# EAGLE design ranback_top (EAGLE 9.6.2)
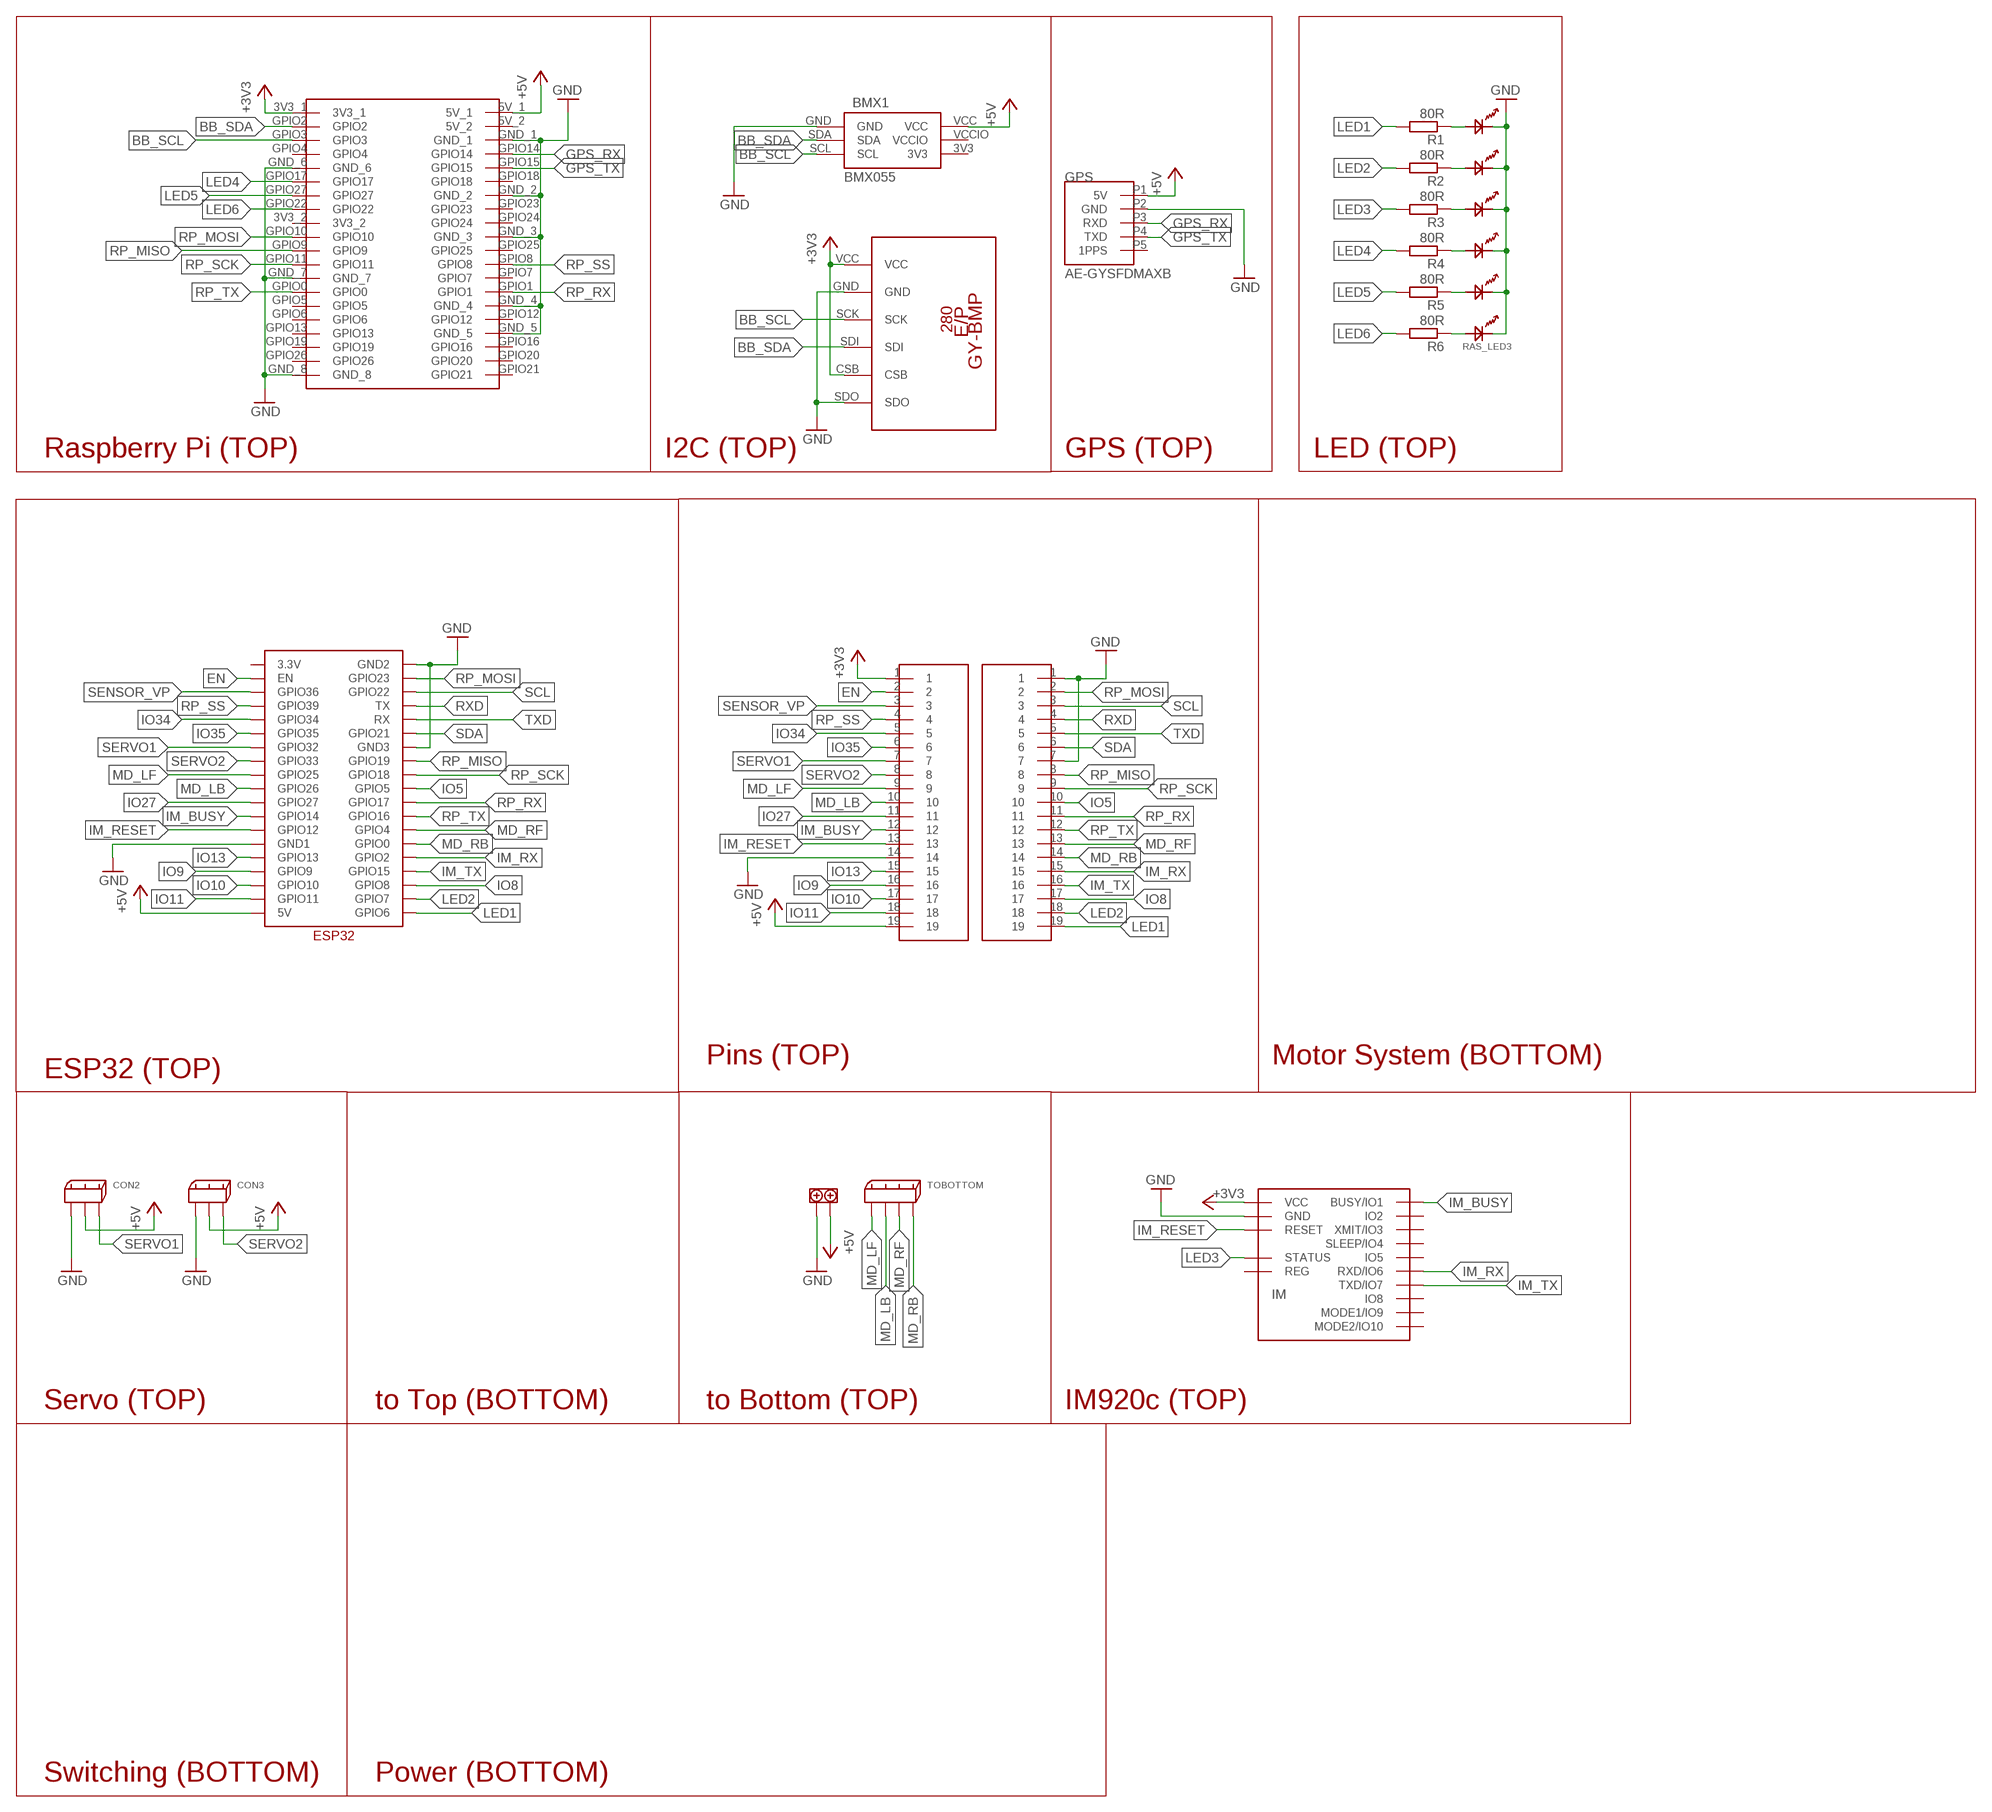
[diagram p0: schematic, sheet 1]

## Parts
BMX1  BMX055  [BMX055]
CON2  2.5_MINI-SPOX_3PIN  [2.5_MINI-SPOX_3PIN]
CON3  2.5_MINI-SPOX_3PIN  [2.5_MINI-SPOX_3PIN]
ESP_LED1  OSXX1608C1A  [OSXX1608C1A]
ESP_LED2  OSXX1608C1A  [OSXX1608C1A]
GPS  AE-GYSFDMAXB  [AE-GYSFDMAXB]
IM  IM920C  [IM920C]
IMCHECK  OSXX1608C1A  [OSXX1608C1A]
PIN_L  19_2.54  [19_2.54]
PIN_R  19_2.54  [19_2.54]
R1  80R  R-EU_0207/10  [0207/10]
R2  80R  R-EU_0207/10  [0207/10]
R3  80R  R-EU_0207/10  [0207/10]
R4  80R  R-EU_0207/10  [0207/10]
R5  80R  R-EU_0207/10  [0207/10]
R6  80R  R-EU_0207/10  [0207/10]
RAS_LED1  OSXX1608C1A  [OSXX1608C1A]
RAS_LED2  OSXX1608C1A  [OSXX1608C1A]
RAS_LED3  OSXX1608C1A  [OSXX1608C1A]
RASPBERRYPI_4B  RASPBERRYPI4B  [RASPBERRYPI4B]
TM5  TERMINAL_SLOPED_2PIN  [TERMINAL_SLOPED_2PIN]
TOBOTTOM  2.5_MINI-SPOX_4PIN  [2.5_MINI-SPOX_4PIN]
U$2  ESP32  [ESP32]
U$9  GY-BPM280  [GY-BMP280-FOOTPRINT]

## Nets
+3V3: IM.$P17(VCC) PIN_L.1 RASPBERRYPI_4B.3V3_1 U$9.CSB U$9.VCC
+5V: BMX1.VCC CON2.2 CON3.2 GPS.P1(5V) PIN_L.19 RASPBERRYPI_4B.5V_1 TM5.1 U$2.5V
BB_SCL: BMX1.SCL RASPBERRYPI_4B.GPIO3 U$9.SCK
BB_SDA: BMX1.SDA RASPBERRYPI_4B.GPIO2 U$9.SDI
EN: PIN_L.2 U$2.EN
GND [GND_+12V]: BMX1.GND CON2.1 CON3.1 ESP_LED1.CT ESP_LED2.CT GPS.P2(GND) IM.$P18(GND) IMCHECK.CT PIN_L.14 PIN_R.1 PIN_R.7 RAS_LED1.CT RAS_LED2.CT RAS_LED3.CT RASPBERRYPI_4B.GND_1 RASPBERRYPI_4B.GND_2 RASPBERRYPI_4B.GND_3 RASPBERRYPI_4B.GND_4 RASPBERRYPI_4B.GND_5 RASPBERRYPI_4B.GND_6 RASPBERRYPI_4B.GND_7 RASPBERRYPI_4B.GND_8 TM5.2 U$2.GND1 U$2.GND2 U$2.GND3 U$9.GND U$9.SDO
GPS_RX: GPS.P3(RXD) RASPBERRYPI_4B.GPIO14
GPS_TX: GPS.P4(TXD) RASPBERRYPI_4B.GPIO15
IM_BUSY: IM.$P1(BUSY/IO1) PIN_L.12 U$2.GPIO14
IM_RESET: IM.$P19(RESET) PIN_L.13 U$2.GPIO12
IM_RX: IM.$P6(RXD/IO6) PIN_R.15 U$2.GPIO2
IM_TX: IM.$P7(TXD/IO7) PIN_R.16 U$2.GPIO15
IO5: PIN_R.10 U$2.GPIO5
IO8: PIN_R.17 U$2.GPIO8
IO9: PIN_L.16 U$2.GPIO9
IO10: PIN_L.17 U$2.GPIO10
IO11: PIN_L.18 U$2.GPIO11
IO13: PIN_L.15 U$2.GPIO13
IO27: PIN_L.11 U$2.GPIO27
IO34: PIN_L.5 U$2.GPIO34
IO35: PIN_L.6 U$2.GPIO35
LED1: PIN_R.19 R1.2 U$2.GPIO6
LED2: PIN_R.18 R2.2 U$2.GPIO7
LED3: IM.$P15(STATUS) R3.2
LED4: R4.2 RASPBERRYPI_4B.GPIO17
LED5: R5.2 RASPBERRYPI_4B.GPIO27
LED6: R6.2 RASPBERRYPI_4B.GPIO22
MD_LB: PIN_L.10 TOBOTTOM.P$2 U$2.GPIO26
MD_LF: PIN_L.9 TOBOTTOM.P$1 U$2.GPIO25
MD_RB: PIN_R.14 TOBOTTOM.P$4 U$2.GPIO0
MD_RF: PIN_R.13 TOBOTTOM.P$3 U$2.GPIO4
N$1: ESP_LED1.AN R1.1
N$2: ESP_LED2.AN R2.1
N$3: IMCHECK.AN R3.1
N$4: R4.1 RAS_LED1.AN
N$5: R5.1 RAS_LED2.AN
N$6: R6.1 RAS_LED3.AN
RP_MISO: PIN_R.8 RASPBERRYPI_4B.GPIO9 U$2.GPIO19
RP_MOSI: PIN_R.2 RASPBERRYPI_4B.GPIO10 U$2.GPIO23
RP_RX: PIN_R.11 RASPBERRYPI_4B.GPIO1 U$2.GPIO17
RP_SCK: PIN_R.9 RASPBERRYPI_4B.GPIO11 U$2.GPIO18
RP_SS: PIN_L.4 RASPBERRYPI_4B.GPIO8 U$2.GPIO39
RP_TX: PIN_R.12 RASPBERRYPI_4B.GPIO0 U$2.GPIO16
RXD [esp]: PIN_R.4 U$2.TX
SCL: PIN_R.3 U$2.GPIO22
SDA: PIN_R.6 U$2.GPIO21
SENSOR_VP: PIN_L.3 U$2.GPIO36
SERVO1: CON2.3 PIN_L.7 U$2.GPIO32
SERVO2: CON3.3 PIN_L.8 U$2.GPIO33
TXD [esp]: PIN_R.5 U$2.RX
Unconnected: GPS.P5(1PPS) IM.$P2(IO2) IM.$P3(XMIT/IO3) IM.$P4(SLEEP/IO4) IM.$P5(IO5) IM.$P8(IO8) IM.$P9(MODE1/IO9) IM.$P10(MODE2/IO10) IM.$P16(REG) RASPBERRYPI_4B.3V3_2 RASPBERRYPI_4B.5V_2 RASPBERRYPI_4B.GPIO4 RASPBERRYPI_4B.GPIO5 RASPBERRYPI_4B.GPIO6 RASPBERRYPI_4B.GPIO7 RASPBERRYPI_4B.GPIO12 RASPBERRYPI_4B.GPIO13 RASPBERRYPI_4B.GPIO16 RASPBERRYPI_4B.GPIO18 RASPBERRYPI_4B.GPIO19 RASPBERRYPI_4B.GPIO20 RASPBERRYPI_4B.GPIO21 RASPBERRYPI_4B.GPIO23 RASPBERRYPI_4B.GPIO24 RASPBERRYPI_4B.GPIO25 RASPBERRYPI_4B.GPIO26 U$2.3.3V

## Notes on the sheet
- Raspberry Pi (TOP) | I2C (TOP) | GPS (TOP) | LED (TOP)
- Pins (TOP) | Motor System (BOTTOM)
- ESP32 (TOP)
- Servo (TOP) | to Top (BOTTOM) | to Bottom (TOP) | IM920c (TOP)
- Switching (BOTTOM) | Power (BOTTOM)

## Power pins joined to a net without a drawn wire
3V3: BMX1.3V3
VCCIO: BMX1.VCCIO

## Library data of the parts
BMX1 = BMX055:BMX055
CON2 CON3 = Connector:2.5_MINI-SPOX_3PIN
ESP_LED1 ESP_LED2 IMCHECK RAS_LED1-RAS_LED3 = ChipLED:OSXX1608C1A
GPS = AE-GYSFDMAXB:AE-GYSFDMAXB
IM = IM920:IM920C
PIN_L PIN_R = JumperPins:19_2.54
R1-R6 = rcl:R-EU_: RESISTOR, European symbol; SPICEPREFIX: R
RASPBERRYPI_4B = RASPBERRYPI4B:RASPBERRYPI4B
TM5 = TerminalBrock:TERMINAL_SLOPED_2PIN
TOBOTTOM = Connector:2.5_MINI-SPOX_4PIN
U$2 = ESP32_dev:ESP32
U$9 = BMP280:GY-BPM280

## Net classes
1 esp: width 0.254 mm, drill 0.127 mm, clearance 0.025 mm
2 GND_+12V: width 0.305 mm

## Board
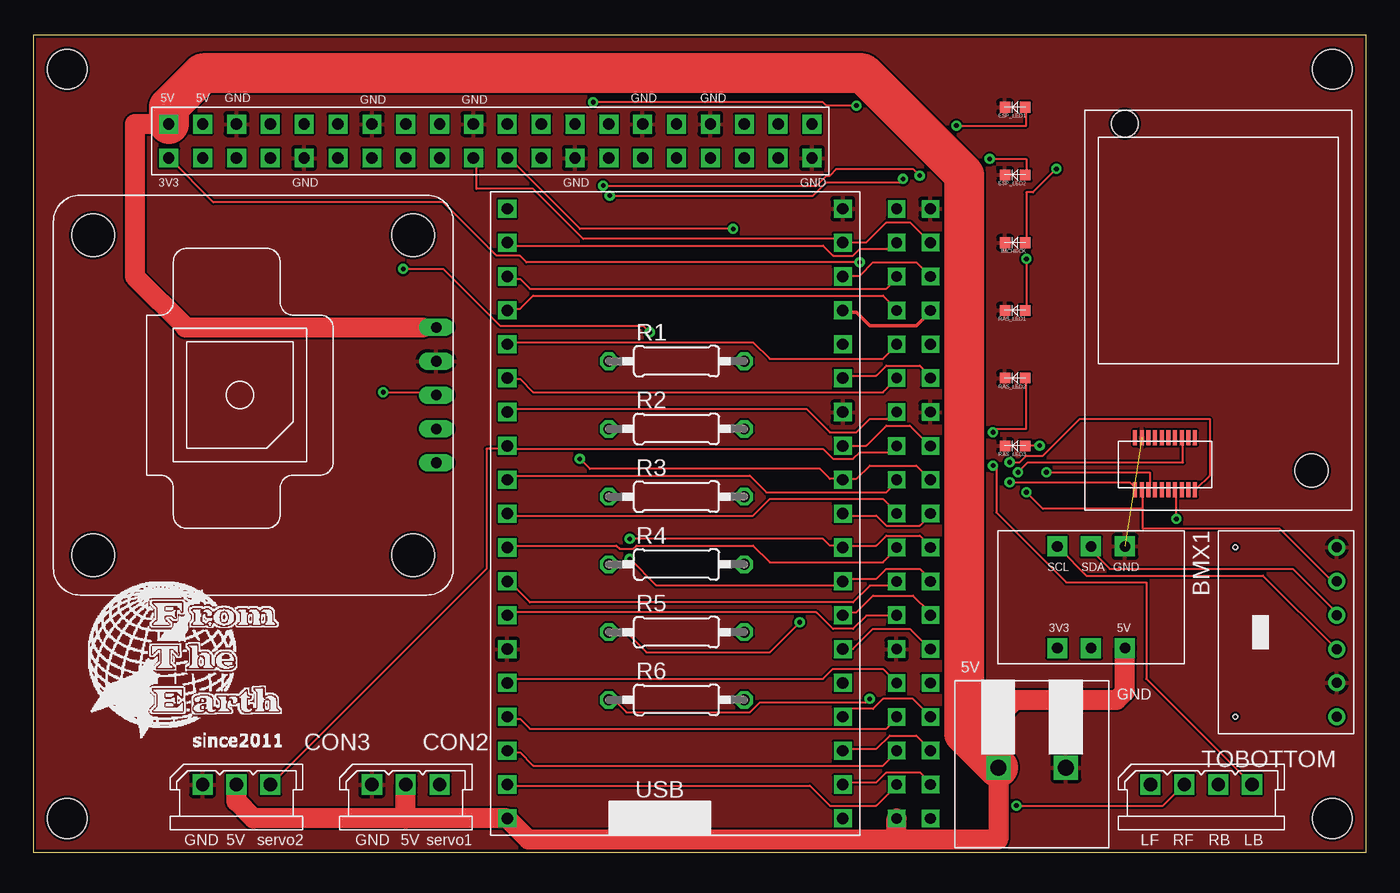
[diagram p1: board, top side]
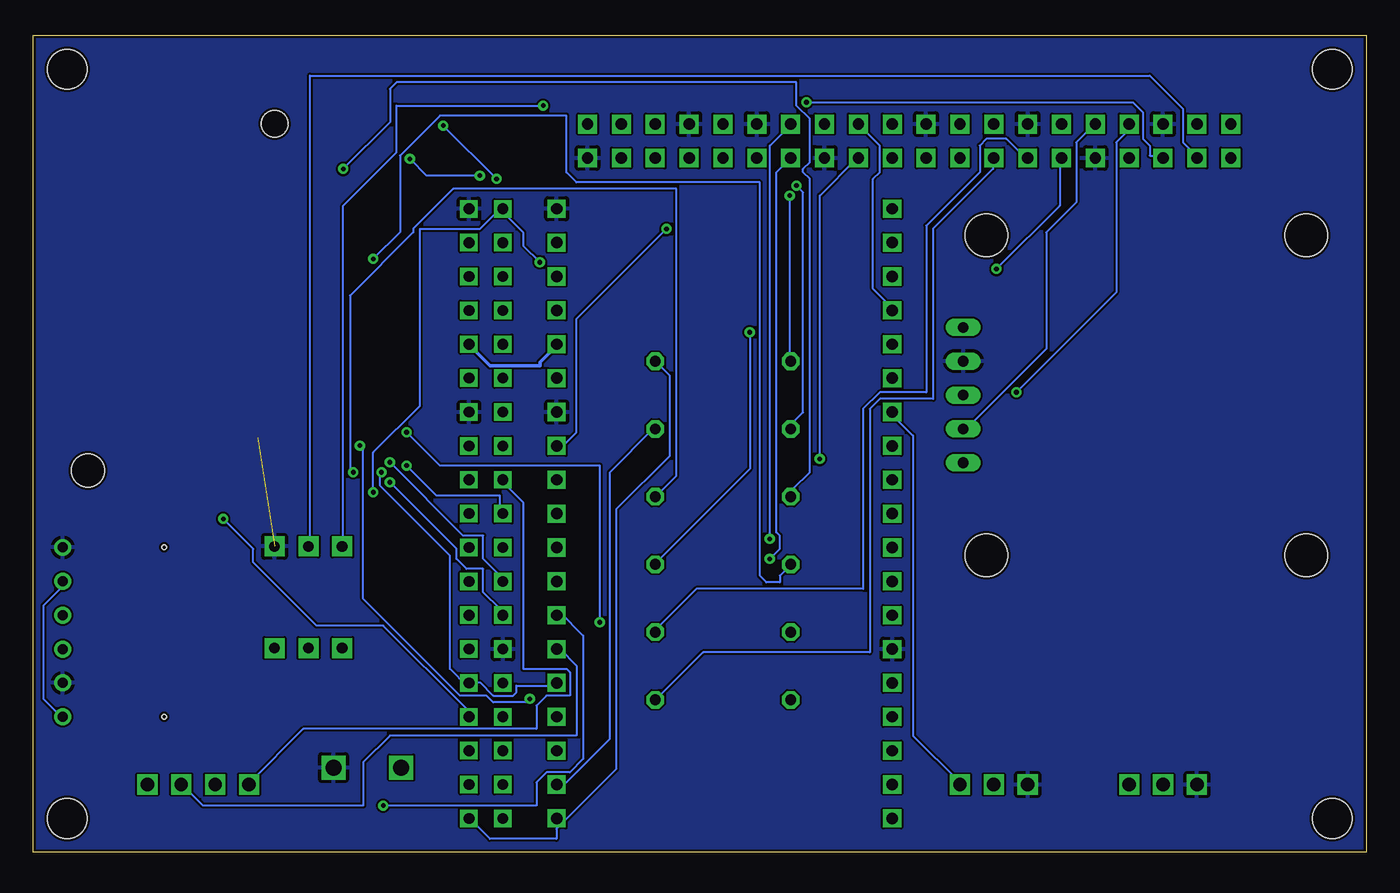
[diagram p2: board, bottom side, seen from below]

Size 100 x 61.27 mm. Coordinates in mm from the lower left corner, seen from the top.
Outline: 0,0 100,0 100,61.27 0,61.27 0,0
Copper layers (1*16): Top 0.035mm / dielectric 1.5mm / Bottom 0.035mm
Design rules "PCBGoGo": minimum track width 6mil, minimum drill 0.2mm, track to track 6mil, track to pad 6mil, pad to pad 6mil, via to via 6mil, smd to smd 6mil, copper to edge 0.2mm, drill to drill 6mil, minimum pad ring 10mil, minimum via ring 8mil, stop-mask expansion 4mil, vias tented up to drill 0mil, thermal gap 10mil
Holes 3 mm at 2.54,2.54 2.54,58.73 97.46,58.73 97.46,2.54

### Footprints (pad centres in the part's own frame; a part is rotated, then mirrored left to right if it is on the bottom)
BMX055 = drill 0.8 pad 1.5 square: 3V3 8.81,-9.53; GND 1.19,-4.46; SCL 1.19,-9.53; SDA 1.19,-7; VCC 8.81,-4.46; VCCIO 8.81,-7
2.5_MINI-SPOX_3PIN = drill 1 square: 1 -1.27,0; 2 1.27,0; 3 3.81,0
OSXX1608C1A = smd 0.8 x 0.8: AN -0.75,0; CT 0.75,0
AE-GYSFDMAXB = drill 0.8 long: P1 13.716,5.08; P2 13.716,2.54; P3 13.716,0; P4 13.716,-2.54; P5 13.716,-5.08 | hole 3.2: -12,12; 12,12; 12,-12; -12,-12
IM920C = smd 0.3 x 1.1: $P1 -1.75,-13.45; $P2 -1.75,-9.55; $P3 -2.25,-13.45; $P4 -2.25,-9.55; $P5 -2.75,-13.45; $P6 -2.75,-9.55; $P7 -3.25,-13.45; $P8 -3.25,-9.55; $P9 -3.75,-13.45; $P10 -3.75,-9.55; $P11 -4.25,-13.45; $P12 -4.25,-9.55; $P13 -4.75,-13.45; $P14 -4.75,-9.55; $P15 -5.25,-13.45; $P16 -5.25,-9.55; $P17 -5.75,-13.45; $P18 -5.75,-9.55; $P19 -6.25,-13.45; $P20 -6.25,-9.55 | hole 2.5: 7,-12 | hole 2: -7,14
19_2.54 = drill 0.8 pad 1.27 square: 1 0,12.7; 2 0,10.16; 3 0,7.62; 4 0,5.08; 5 0,2.54; 6 0,0; 7 0,-2.54; 8 0,-5.08; 9 0,-7.62; 10 0,-10.16; 11 0,-12.7; 12 0,-15.24; 13 0,-17.78; 14 0,-20.32; 15 0,-22.86; 16 0,-25.4; 17 0,-27.94; 18 0,-30.48; 19 0,-33.02
0207/10 = drill 0.813 octagon: 1 -5.08,0; 2 5.08,0
RASPBERRYPI4B = drill 0.85 pad 1.422 square: 3V3_1 -2.54,-2.54; 3V3_2 -2.54,-22.86; 5V_1 0,-2.54; 5V_2 0,-5.08; GND_1 0,-7.62; GND_2 0,-17.78; GND_3 0,-25.4; GND_4 0,-38.1; GND_5 0,-43.18; GND_6 -2.54,-12.7; GND_7 -2.54,-33.02; GND_8 -2.54,-50.8; GPIO0 -2.54,-35.56; GPIO1 0,-35.56; GPIO2 -2.54,-5.08; GPIO3 -2.54,-7.62; GPIO4 -2.54,-10.16; GPIO5 -2.54,-38.1; GPIO6 -2.54,-40.64; GPIO7 0,-33.02; GPIO8 0,-30.48; GPIO9 -2.54,-27.94; GPIO10 -2.54,-25.4; GPIO11 -2.54,-30.48; GPIO12 0,-40.64; GPIO13 -2.54,-43.18; GPIO14 0,-10.16; GPIO15 0,-12.7; GPIO16 0,-45.72; GPIO17 -2.54,-15.24; GPIO18 0,-15.24; GPIO19 -2.54,-45.72; GPIO20 0,-48.26; GPIO21 0,-50.8; GPIO22 -2.54,-20.32; GPIO23 0,-20.32; GPIO24 0,-22.86; GPIO25 0,-27.94; GPIO26 -2.54,-48.26; GPIO27 -2.54,-17.78
TERMINAL_SLOPED_2PIN = drill 1.2 square: 1 -2.54,0; 2 2.54,0
2.5_MINI-SPOX_4PIN = drill 1 square: P$1 -1.27,0; P$2 6.35,0; P$3 1.27,0; P$4 3.81,0
ESP32 = drill 0.85 square: 3.3V 1.27,46.99; 5V 1.27,1.27; EN 1.27,44.45; GND1 1.27,13.97; GND2 26.44,46.99; GND3 26.44,31.75; GPIO0 26.44,13.97; GPIO2 26.44,11.43; GPIO4 26.44,16.51; GPIO5 26.44,24.13; GPIO6 26.44,1.27; GPIO7 26.44,3.81; GPIO8 26.44,6.35; GPIO9 1.27,8.89; GPIO10 1.27,6.35; GPIO11 1.27,3.81; GPIO12 1.27,16.51; GPIO13 1.27,11.43; GPIO14 1.27,19.05; GPIO15 26.44,8.89; GPIO16 26.44,19.05; GPIO17 26.44,21.59; GPIO18 26.44,26.67; GPIO19 26.44,29.21; GPIO21 26.44,34.29; GPIO22 26.44,41.91; GPIO23 26.44,44.45; GPIO25 1.27,26.67; GPIO26 1.27,24.13; GPIO27 1.27,21.59; GPIO32 1.27,31.75; GPIO33 1.27,29.21; GPIO34 1.27,36.83; GPIO35 1.27,34.29; GPIO36 1.27,41.91; GPIO39 1.27,39.37; RX 26.44,36.83; TX 26.44,39.37
GY-BMP280-FOOTPRINT = drill 0.75 pad 1.27: CSB 11.43,0; GND 3.81,0; SCK 6.35,0; SDI 8.89,0; SDO 13.97,0; VCC 1.27,0 | hole 0.35: 1.27,7.62; 13.97,7.62

### Placement (x,y rotation side)
BMX1  86.36,24.13 270 top
CON2  26.67,5.08 0 top
CON3  13.97,5.08 0 top
ESP_LED1  73.66,55.88 180 top
ESP_LED2  73.66,50.8 180 top
GPS  16.51,34.29 0 top
IM  88.9,40.64 0 top
IMCHECK  73.66,45.72 180 top
PIN_L  64.77,35.56 0 top
PIN_R  67.31,35.56 0 top
R1  48.26,36.83 0 top
R2  48.26,31.75 0 top
R3  48.26,26.67 0 top
R4  48.26,21.59 0 top
R5  48.26,16.51 0 top
R6  48.26,11.43 0 top
RAS_LED1  73.66,40.64 180 top
RAS_LED2  73.66,35.56 180 top
RAS_LED3  73.66,30.48 180 top
RASPBERRYPI_4B  7.62,54.61 90 top
TM5  74.93,6.35 0 top
TOBOTTOM  85.09,5.08 0 top
U$1  [LOGO]  3.56,6.48 0 top
U$2  34.29,1.27 0 top
U$9  97.79,8.89 90 top

### Tracks (layer width: path | path; a pad name or v marks a point on that pad's centre or on a via)
+3V3  (via drill 0.35)
  Top 0.152: 83.25,25.75 83.25,24.25 93.5,24.25 97.25,20.5 97.75,20.5 U$9.CSB | 83.25,25.75 83.25,27 IM.$P17 | v74.5,27 75.75,25.75 83.25,25.75 | v62,44.25 37,44.25 36.5,44.75 34.75,44.75 30.75,48.75 13.5,48.75 10.25,52 RASPBERRYPI_4B.3V3_1
  Bottom 0.152: U$9.VCC 98,10.25 99.25,11.5 99.25,18.5 98,19.75 98,20.25 U$9.CSB | v74.5,27 74.5,30 71,33.5 71,46.75 66.5,46.75 65,48.25 PIN_L.1 64.75,48.25 64.75,48 63.25,46.5 63.25,45.5 v62,44.25
+5V
  Top 0.152: GPS.P1 30,39.5 29.75,39.5 29.21,39.37
  Top 1.5: RASPBERRYPI_4B.5V_1 7.62,54.61 7.62,43.18 11.43,39.37 29.21,39.37 | BMX1.VCC 81.9,12.05 81.28,11.43 73.66,11.43 72.39,10.16 TM5.1 72.39,0.95 64.77,0.95 | 64.77,0.95 37.15,0.95 U$2.5V 27.94,2.54 | CON3.2 15.24,3.81 16.51,2.54 27.94,2.54 | 27.94,2.54 CON2.2 | 64.77,0.95 PIN_L.19
  Top 3: TM5.1 69.85,8.89 69.85,50.8 62.23,58.42 12.7,58.42 10.16,55.88 RASPBERRYPI_4B.5V_1
BB_SCL  (via drill 0.35)
  Top 0.152: U$9.SCK 97.75,15.25 92.25,20.75 79,20.75 77,22.75 BMX1.SCL | v42,56.25 59.25,56.25 59.5,56 v61.75,56
  Bottom 0.152: v42,56.25 17.5,56.25 16.75,55.5 16.75,53.5 16.25,53 16.25,52.25 15.25,52.25 RASPBERRYPI_4B.GPIO3 | v61.75,56 72.75,56 72.75,52.5 76.75,48.5 76.75,23 BMX1.SCL
BB_SDA
  Top 0.152: U$9.SDI 97.75,18 94.5,21.25 80.75,21.25 79.25,22.75 BMX1.SDA
  Bottom 0.152: RASPBERRYPI_4B.GPIO2 12.75,52.25 13.75,53.25 13.75,55.75 16.25,58.25 79.25,58.25 79.25,23 BMX1.SDA
EN
  Top 0.152: PIN_L.2 64.75,45.5 64.5,45.25 62,45.25 61.5,44.75 60,44.75 59.25,45.5 35.75,45.5 U$2.EN
GND  (1 unrouted)
  pour Top: -1.27,62.23 101.6,62.23 101.6,-2.54 -1.27,-2.54
  pour Bottom: -1.27,62.23 101.6,62.23 101.6,-1.27 -1.27,-1.27
GPS_RX  (via drill 0.35)
  Top 0.152: v26.25,34.5 30,34.5 GPS.P3
  Bottom 0.152: v26.25,34.5 18.75,42 18.75,53.25 18,54 18,54.5 RASPBERRYPI_4B.GPIO14
GPS_TX
  Bottom 0.152: GPS.P4 30,31.75 24,37.75 24,46.5 21.75,48.75 21.75,53.25 20.5,54.5 RASPBERRYPI_4B.GPIO15
IM_BUSY  (via drill 0.35)
  Top 0.152: v73.25,29.25 74,29.25 74.5,29.75 75.75,29.75 78.5,32.5 88.25,32.5 88.25,28.25 87.25,27.25 IM.$P1 | U$2.GPIO14 35.75,20.25 37.25,18.75 61.5,18.75 62.75,20 64.5,20 64.75,20.25 PIN_L.12
  Bottom 0.152: v73.25,29.25 67.75,23.75 66.25,23.75 66.25,22 65,20.75 65,20.5 PIN_L.12
IM_RESET  (via drill 0.35)
  Top 0.152: v73.25,27.75 82.25,27.75 82.75,27.25 IM.$P19 | U$2.GPIO12 35.75,18 58.75,18 60,16.75 61.5,16.75 62.5,17.75 64.75,17.75 PIN_L.13
  Bottom 0.152: v73.25,27.75 68.25,22.75 68.25,22 67.5,21.25 66.25,21.25 66.25,19.5 65,18.25 65,18 PIN_L.13
IM_RX  (via drill 0.35)
  Top 0.152: v73.88,28.5 74.63,29.25 86.25,29.25 86.25,31 IM.$P6
  Bottom 0.152: v73.88,28.5 74,28.38 74,27.5 68.75,22.25 68.75,13.75 67.5,12.5 PIN_R.15 67.25,12.75 66.5,12.75 65.5,11.75 64,11.75 63.75,12 63.75,12.5 60.75,12.5 U$2.GPIO2
IM_TX  (via drill 0.35)
  Top 0.152: v85.75,25 85.75,27 IM.$P7 | U$2.GPIO15 60.75,10.25 61.25,10.75 63,10.75 63.75,11.5 66,11.5 67.25,10.25 PIN_R.16
  Bottom 0.152: v85.75,25 83.5,22.75 83.5,21.75 78.75,17 73.75,17 67.5,10.75 67.5,10.25 PIN_R.16
IO5
  Top 0.152: PIN_R.10 67.25,25.25 66.5,24.5 64,24.5 63.25,25.25 60.75,25.25 U$2.GPIO5
IO8
  Top 0.152: PIN_R.17 67.25,7.75 66.25,8.75 64.25,8.75 63.25,7.75 60.75,7.75 U$2.GPIO8
IO9
  Top 0.152: PIN_L.16 64.75,10 64,9.25 37.25,9.25 36.5,10 35.75,10 U$2.GPIO9
IO10
  Top 0.152: PIN_L.17 64.75,7.5 63.75,6.5 37.5,6.5 36.5,7.5 35.75,7.5 U$2.GPIO10
IO11
  Top 0.152: PIN_L.18 64.75,5 63.25,3.5 59.75,3.5 58.25,5 35.75,5 U$2.GPIO11
IO13
  Top 0.152: PIN_L.15 64.75,12.75 63.75,13.75 60,13.75 59.25,13 36,13 35.75,12.75 U$2.GPIO13
IO27
  Top 0.152: PIN_L.11 64.75,22.75 63.75,21.75 55.25,21.75 54,23 45.25,23 45,22.75 44,22.75 43.75,23 35.75,23 U$2.GPIO27
IO34
  Top 0.152: PIN_L.5 64.75,38 63.75,37 55.25,37 54,38.25 35.75,38.25 U$2.GPIO34
IO35
  Top 0.152: PIN_L.6 64.75,35.5 63.75,34.5 37.5,34.5 36.5,35.5 35.75,35.5 U$2.GPIO35
LED1
  Bottom 0.152: 60.75,1.75 60.75,2.5 U$2.GPIO6 | 60.75,1.75 60.75,1 65.75,1 67.25,2.5 PIN_R.19 | 60.75,1.75 56.25,6.25 56.25,25.75 52.25,29.75 52.25,35.75 53.25,36.75 R1.2
LED2
  Top 0.152: PIN_R.18 67.25,5.25 66.5,6 64,6 63.25,5.25 60.75,5.25 U$2.GPIO7
  Bottom 0.152: R2.2 53.5,31.75 56.75,28.5 56.75,8.5 60,5.25 60.5,5.25 U$2.GPIO7
LED3  (via drill 0.35)
  Top 0.152: v76,28.5 83.75,28.5 83.75,27.25 IM.$P15
  Bottom 0.152: v76,28.5 76.25,28.75 76.25,41.75 71.5,46.5 71.5,46.75 68.5,49.75 51.75,49.75 51.75,28.25 53.25,26.75 R3.2
LED4  (via drill 0.35)
  Top 0.152: v46.25,39 45.75,39.5 35,39.5 30.75,43.75 v27.75,43.75
  Bottom 0.152: v46.25,39 46.25,28.75 53.25,21.75 R4.2 | v27.75,43.75 23,48.5 23,52 RASPBERRYPI_4B.GPIO17
LED5
  Bottom 0.152: R5.2 53.25,16.75 50.25,19.75 37.75,19.75 37.75,33.25 36.5,34.5 33,34.5 33,47 29,51 29,53 28.5,53.5 27,53.5 25.5,52 RASPBERRYPI_4B.GPIO27
LED6
  Bottom 0.152: R6.2 53.25,11.5 49.75,15 37.25,15 37.25,33.25 36.5,34 32.5,34 32.5,46.75 28,51.25 28,52 RASPBERRYPI_4B.GPIO22
MD_LB  (via drill 0.35)
  Top 0.152: PIN_L.10 64.75,25.5 63.75,26.5 55.25,26.5 54,25.25 35.75,25.25 U$2.GPIO26 | v72,29 72.25,29 72.25,25.5 77.5,20.25 83.5,20.25 83.5,13 91.25,5.25 TOBOTTOM.P$2
  Bottom 0.152: v72,29 69.75,26.75 65,26.75 65,25.5 PIN_L.10
MD_LF
  Top 0.152: PIN_L.9 64.75,27.75 64,27 55,27 53.75,28.25 36,28.25 35.75,28 U$2.GPIO25
  Bottom 0.152: TOBOTTOM.P$1 83.75,5.25 79.75,9.25 62.25,9.25 62.25,11 61.5,11.75 59.75,11.75 59.75,13.5 60,13.75 63.25,13.75 63.25,26.25 64.75,27.75 PIN_L.9
MD_RB
  Top 0.152: PIN_R.14 67.25,15.25 65.75,16.75 63,16.75 61.5,15.25 60.75,15.25 U$2.GPIO0
  Bottom 0.152: TOBOTTOM.P$4 88.75,5 87.25,3.5 75.25,3.5 75.25,6.75 73.25,8.75 59.25,8.75 59.25,14 60.5,15.25 U$2.GPIO0
MD_RF  (via drill 0.35)
  Top 0.152: PIN_R.13 67.25,18 66,19.25 63,19.25 61.75,18 60.75,18 U$2.GPIO4 | v73.75,3.5 84.75,3.5 86.25,5 TOBOTTOM.P$3
  Bottom 0.152: v73.75,3.5 62.25,3.5 62.25,5.25 61.5,6 59.75,6 58.75,7 58.75,16.25 60.5,18 U$2.GPIO4
N$1  (via drill 0.35)
  Top 0.152: v69.25,54.5 74.5,54.5 74.5,55.75 ESP_LED1.AN | v65.25,50.5 65,50.25 59.5,50.25 58.5,49.25 v43.25,49.25
  Bottom 0.152: v65.25,50.5 v69.25,54.5 | v43.25,49.25 43.25,37 R1.1
N$2  (via drill 0.35)
  Top 0.152: v71.75,52 74.5,52 74.5,51 ESP_LED2.AN | v66.5,50.75 66,51.25 60.25,51.25 59.75,50.75 59.5,50.75 58.75,50 v42.75,50
  Bottom 0.152: v71.75,52 70.5,50.75 v66.5,50.75 | v42.75,50 42.25,49.5 42.25,33 43,32.25 43,31.75 R2.1
N$3  (via drill 0.35)
  Top 0.152: v76.75,51.25 75,49.5 74.5,49.5 74.5,45.75 IMCHECK.AN
  Bottom 0.152: v76.75,51.25 73.25,54.75 73.25,57.25 72.75,57.75 42.75,57.75 42.75,56 41.75,55 41.75,51.75 42.25,51.25 42.25,51 41.75,50.5 41.75,28.5 43,27.25 43,26.75 R3.1
N$4  (via drill 0.35)
  Top 0.152: v74.5,44.5 74.5,40.75 RAS_LED1.AN
  Bottom 0.152: v74.5,44.5 72.5,46.5 72.5,52.25 69.5,55.25 60,55.25 60,51 59.25,50.25 45.5,50.25 45.5,20.75 45,20.25 44,20.25 44,20.75 43.25,21.5 R4.1
N$5  (via drill 0.35)
  Top 0.152: v72,31.5 72.25,31.75 74.5,31.75 74.5,35.5 RAS_LED2.AN | v57.5,17.25 55.25,15 46,15 44.5,16.5 43.25,16.5 R5.1
  Bottom 0.152: v72,31.5 69.5,29 57.5,29 v57.5,17.25
N$6  (via drill 0.35)
  Top 0.152: v75.5,30.5 74.5,30.5 RAS_LED3.AN | v62.75,11.5 62.5,11.25 54.5,11.25 53.75,10.5 44.5,10.5 43.75,11.25 43.25,11.25 R6.1
  Bottom 0.152: v75.5,30.5 75.25,30.25 75.25,19 68,11.75 66,11.75 65.5,11.25 62.75,11.25 v62.75,11.5
RP_MISO  (via drill 0.35)
  Top 0.152: PIN_R.8 67.25,30.5 65.75,32 64,32 62.5,30.5 60.75,30.5 U$2.GPIO19 | v52.5,46.75 41,46.75 35.75,52 RASPBERRYPI_4B.GPIO9
  Bottom 0.152: v52.5,46.75 59.25,40 59.25,31.5 60.5,30.25 U$2.GPIO19
RP_MOSI
  Top 0.152: PIN_R.2 67.25,45.75 65.75,47.25 64,47.25 62.5,45.75 60.75,45.75 U$2.GPIO23 60.5,45.75 60.25,46 41.25,46 37.5,49.75 33.25,49.75 33.25,52 RASPBERRYPI_4B.GPIO10
RP_RX  (via drill 0.35)
  Top 0.152: PIN_R.11 67.25,23 66.5,23.75 64,23.75 63.25,23 60.75,23 U$2.GPIO17 60.5,23 59.75,23 59.25,23.5 v44.75,23.5
  Bottom 0.152: v44.75,23.5 44.75,53 43.25,54.5 RASPBERRYPI_4B.GPIO1
RP_SCK  (via drill 0.35)
  Top 0.152: PIN_R.9 66.25,29 62.75,29 61.75,28 60.75,28 U$2.GPIO18 60.5,28 59.75,28 59,28.75 41.75,28.75 v41,29.5
  Bottom 0.152: v41,29.5 41,49.25 38.25,52 RASPBERRYPI_4B.GPIO11
RP_SS
  Top 0.152: PIN_L.4 64.75,40.75 63.75,41.75 37.5,41.75 36.5,40.75 35.75,40.75 U$2.GPIO39
  Bottom 0.152: RASPBERRYPI_4B.GPIO8 38,54.5 36.5,53 36.5,51 37,50.5 37,42.25 35.75,41 35.75,40.75 U$2.GPIO39
RP_TX  (via drill 0.35)
  Top 0.152: PIN_R.12 67.25,20.5 66.5,21.25 64,21.25 63.25,20.5 60.75,20.5 U$2.GPIO16 60.5,20.25 60.25,20 46.75,20 v44.75,22
  Bottom 0.152: RASPBERRYPI_4B.GPIO0 44.25,51 44.25,24 44,23.75 44,22.75 v44.75,22
RXD
  Top 0.254: PIN_R.4 67.25,40.5 66.25,39.5 62.75,39.5 61.75,40.5 60.75,40.5 U$2.TX
SCL
  Top 0.152: PIN_R.3 67.25,43.25 66.25,44.25 63,44.25 62,43.25 60.75,43.25 U$2.GPIO22
SDA
  Top 0.152: PIN_R.6 67.25,35.75 66.5,36.5 64,36.5 63.25,35.75 60.75,35.75 U$2.GPIO21
SENSOR_VP
  Top 0.152: PIN_L.3 64.75,43 64,42.25 37.25,42.25 36.5,43 35.75,43 U$2.GPIO36
SERVO1
  Top 0.152: PIN_L.7 64.25,32.5 62.75,32.5 61.75,31.5 59.75,31.5 58,33.25 35.75,33.25 U$2.GPIO32
  Bottom 0.152: CON2.3 30.5,5.25 34,8.75 34,31.25 35.5,32.75 35.5,33 U$2.GPIO32
SERVO2
  Top 0.152: PIN_L.8 64.75,30.25 64.5,30 62,30 61.5,29.5 60,29.5 59.25,30.25 35.75,30.25 U$2.GPIO33 35.5,30.25 34,30.25 34,21.25 18,5.25 CON3.3
TXD
  Bottom 0.254: PIN_R.5 67.25,38 65.75,36.5 62,36.5 62,36.75 60.75,38 U$2.RX

### Text on the board
tPlace: 5V | 5V | GND | GND | GND | GND | GND | 3V3 | GND | GND | GND | SCL | SDA | GND | 3V3 | 5V | 5V | GND | GND | 5V | servo2 | GND | 5V | servo1 | LF | RF | RB | LB